# Altium schematic sheet QSPI.SchDoc: QSPI Flash
size A4; Author: P.A.; CompanyName: STMicroelectronics; Organization: Microcontrollers Division; Address1: 12, Rue Jules HOROWITZ; Address2: 38019 Grenoble; Address3: FRANCE; DocumentNumber: MB1261; Revision: B.01; SheetNumber: 6; SheetTotal: 15; Project: STM32L496G-DISCO
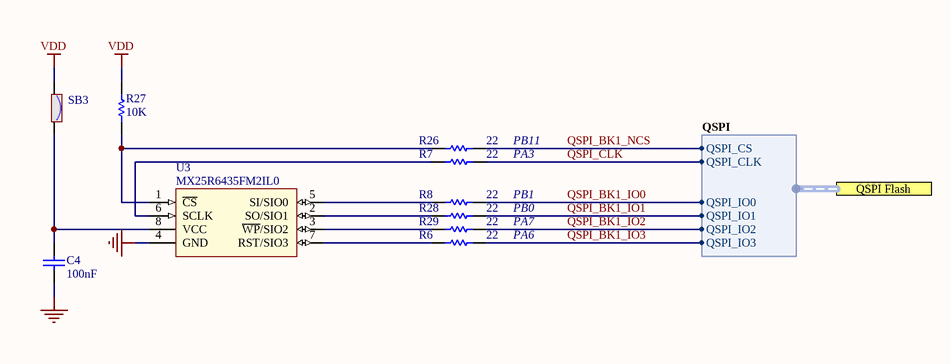
[diagram p0: QSPI.SchDoc]

## Parts
C4  value 100nF  [0603C]  (hidden comment: CC0603KRX7R7BB104)
R6  value 22  [0603R]  (hidden comment: RC0603JR-0722RL)
R7  value 22  [0603R]  (hidden comment: RC0603JR-0722RL)
R8  value 22  [0603R]  (hidden comment: RC0603JR-0722RL)
R26  value 22  [0603R]  (hidden comment: RC0603JR-0722RL)
R27  value 10K  [0603R]  (hidden comment: RC0603FR-0710KL)
R28  value 22  [0603R]  (hidden comment: RC0603JR-0722RL)
R29  value 22  [0603R]  (hidden comment: RC0603JR-0722RL)
SB3  Solder Bridge ON  [SB_0603]  (value not drawn)
U3  MX25R6435FM2IL0  [SOIC8_1R27_5R28X7R9]

## Ports
QSPI Flash (harness QSPI)

## Harnesses
QSPI: QSPI_IO1, QSPI_IO0, QSPI_CLK, QSPI_CS, QSPI_IO2, QSPI_IO3

## Nets
GND: C4.2 U3.4(GND)
VDD: R27.2 SB3.1
QSPI_BK1_IO0: R8.1 ; port QSPI Flash.QSPI_IO0
QSPI_BK1_IO1: R28.1 ; port QSPI Flash.QSPI_IO1
QSPI_BK1_IO2: R29.1 ; port QSPI Flash.QSPI_IO2
QSPI_BK1_IO3: R6.1 ; port QSPI Flash.QSPI_IO3
QSPI_BK1_NCS: R26.1 ; port QSPI Flash.QSPI_CS
QSPI_CLK: R7.1 ; port QSPI Flash.QSPI_CLK
NetC4_1: C4.1 SB3.2 U3.8(VCC)
NetR6_2: R6.2 U3.7(RST/SIO3)
NetR7_2: R7.2 U3.6(SCLK)
NetR8_2: R8.2 U3.5(SI/SIO0)
NetR26_2: R26.2 R27.1 U3.1(~{CS})
NetR28_2: R28.2 U3.2(SO/SIO1)
NetR29_2: R29.2 U3.3(~{WP}/SIO2)

## Notes on the sheet
- PB11
- PA3
- PB0
- PB1
- PA6
- PA7
- Title:
- Project:
- Size:
- Revision:
- Variant:
- A4
- -
- Date:
- Reference:
- Sheet:
- of

## Library data of the parts
C4 = Cap: Capacitor,100nF,10%,16V,X7R,0603,YAGEO; Ordered by: Subcon; Published: 8-Jun-2000; Revision: July-2002: Re-released for DXP Platform.; Publisher: Altium Limited; Manuf_1: YAGEO; Manuf_Part_1: CC0603KRX7R7BB104
R6-R8 R26 R28 R29 = res1: Resistor, 22 ,0603,1%,YAGEO; Ordered by: Subcon; ECCN_US/EU: NA; Published: 8-Jun-2000; Revision: July-2002: Re-released for DXP Platform.; Publisher: Altium Limited; Manuf_1: YAGEO; Manuf_Part_1: RC0603JR-0722RL
R27 = res1: Resistor,10K,0603,1%,YAGEO; Ordered by: Subcon; ECCN_US/EU: NA; Published: 8-Jun-2000; Revision: July-2002: Re-released for DXP Platform.; Publisher: Altium Limited; Manuf_1: YAGEO; Manuf_Part_1: RC0603FR-0710KL
SB3 = SB_ON: Manuf_1: YAGEO; Manuf_Part_1: RC0603JR-070RL; Solder: YES; Ordered By: Subcon; Revision: July-2002: Re-released for DXP Platform.; ECCN_US/EU: N/A
U3 = MX25R6435FM2IL0: Ultra Low Power 64M-BIT CMOS MXSMIO FLASH MEMORY; Manuf_1: MXIC; Ordered by: Subcon; Manuf_Part_1: MX25R6435FM2IL0